# EAGLE design Lab2-th (EAGLE 7.2.0)
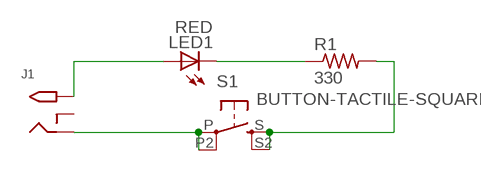
[diagram p0: schematic, sheet 1]

## Parts
J1  2.1MMJACKTHM  [PJ-102A]
LED1  RED  LED5MM  [LED5MM]
R1  330  RESISTORTH-1/4W-CARBON  [RESAD1160W55L680D260_HS]
S1  BUTTON-TACTILE-SQUARE  [BUTTON-TACTILE-SQUARE-ADAFRUIT1010]

## Nets
N$1: LED1.K(C) R1.1
N$2: R1.2 S1.S S1.S2(S1)
N$3: J1.RING S1.P S1.P2(P1)
N$4: J1.TIP LED1.A
Unconnected: J1.RING_SW

## Library data of the parts
J1 = Lab2:2.1MMJACK: 2.1mm x 5.5mm THM DC jack with internal switch. Digikey part #PJ-102A, 4UCON part #05537 2.1mm x 5.5mm SMT DC jack with internal switch. Digikey part #PJ-002A-SMT, 4UCON part #03267 By microbuilder.eu & adafruit.com
LED1 = Lab2:LED: LED OSRAM: - CHIPLED LG R971, LG N971, LY N971, LG Q971, LY Q971, LO R971, LY R971 LH N974, LH R974 LS Q976, LO Q976, LY Q976 LO Q996 - Hyper CHIPLED LW Q18S LB Q993, LB Q99A, LB R99A - SideLED LS A670, LO A670, LY A670, LG A670, LP A670 LB A673, LV A673, LT A673, LW A673 LH A674 LY A675 LS A676, LA A676, LO A676, LY A676, LW A676 LS A679, LY A679, LG A679 - Hyper Micro SIDELED® LS Y876, LA Y876, LO Y876, LY Y876 LT Y87S - SmartLED LW L88C, LW L88S LB L89C, LB L89S, LG L890 LS L89K, LO L89K, LY L89K LS L896, LA L896, LO L896, LY L896 - TOPLED LS T670, LO T670, LY T670, LG T670, LP T670 LSG T670, LSP T670, LSY T670, LOP T670, LYG T670 LG T671, LOG T671, LSG T671 LB T673, LV T673, LT T673, LW T673 LH T674 LS T676, LA T676, LO T676, LY T676, LB T676, LH T676, LSB T676, LW T676 LB T67C, LV T67C, LT T67C, LS T67K, LO T67K, LY T67K, LW E67C LS E67B, LA E67B, LO E67B, LY E67B, LB E67C, LV E67C, LT E67C LW T67C LS T679, LY T679, LG T679 LS T770, LO T770, LY T770, LG T770, LP T770 LB T773, LV T773, LT T773, LW T773 LH T774 LS E675, LA E675, LY E675, LS T675 LS T776, LA T776, LO T776, LY T776, LB T776 LHGB T686 LT T68C, LB T68C - Hyper Mini TOPLED® LB M676 - Mini TOPLED Santana® LG M470 LS M47K, LO M47K, LY M47K Source: http://www.osram.convergy.de/
R1 = Lab2:RESISTOR
S1 = James_Lab2:BUTTON-TACTILE

## Board
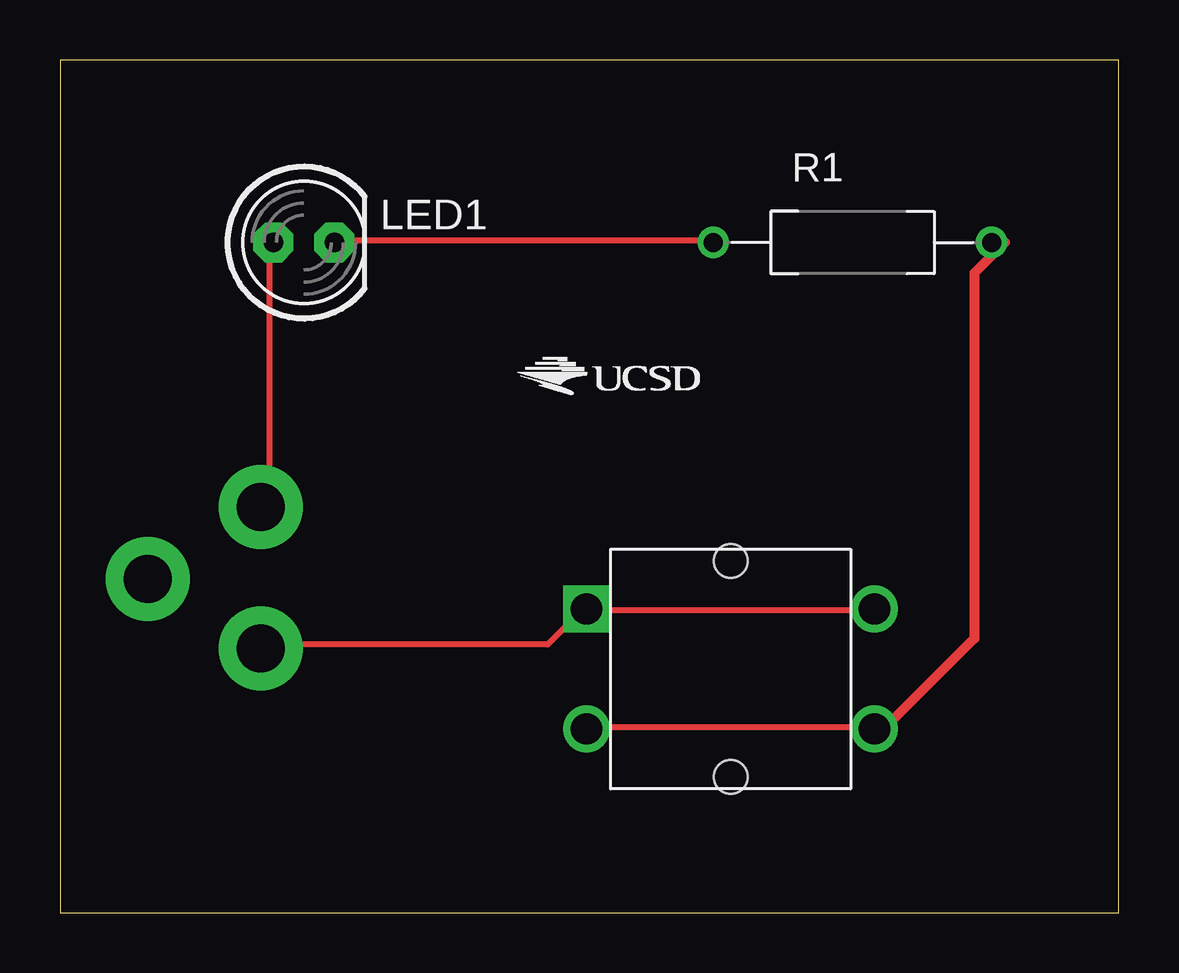
[diagram p1: board, top side]
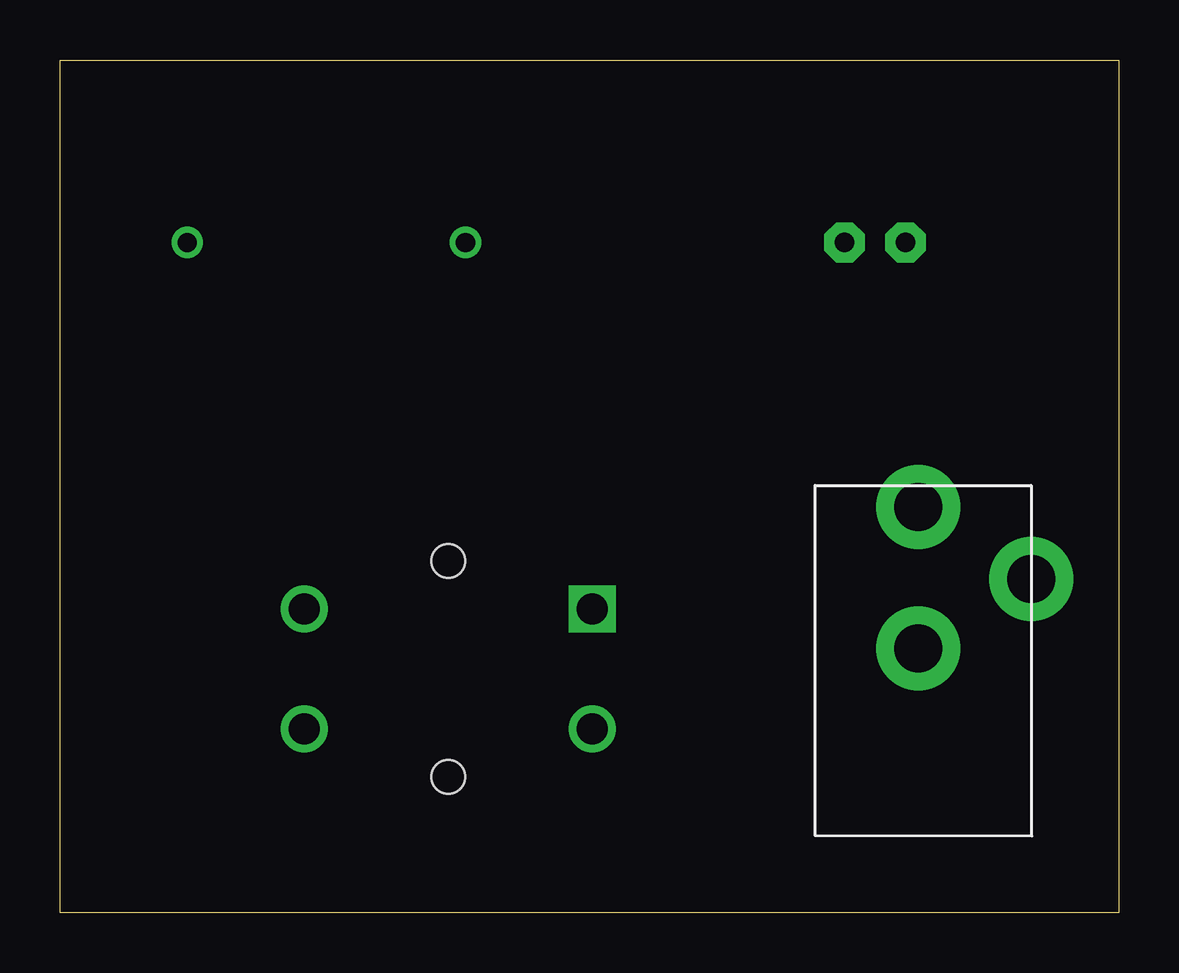
[diagram p2: board, bottom side, seen from below]

Size 44.12 x 35.55 mm. Coordinates in mm from the lower left corner, seen from the top.
Outline: 0,0 44.12,0 44.12,35.55 0,35.55 0,0
Copper layers (1*16): Top 0.035559375mm / dielectric 1.501140625mm / Bottom 0.035559375mm
Design rules "4pcb-33board": minimum track width 10mil, minimum drill 15mil, track to track 6mil, track to pad 6mil, pad to pad 6mil, via to via 6mil, smd to smd 6mil, copper to edge 10mil, drill to drill 10mil, minimum pad ring 10mil, minimum via ring 8mil, stop-mask expansion 4mil, vias tented up to drill 0mil, thermal gap 10mil

### Footprints (pad centres in the part's own frame; a part is rotated, then mirrored left to right if it is on the bottom)
PJ-102A = drill 2 pad 3.5: RING -6.77,-4.345; RING_SW -3.87,-9.045; TIP -0.87,-4.345
LED5MM = drill 0.813 pad 1.676 octagon: A -1.27,0; K 1.27,0
RESAD1160W55L680D260_HS = drill 0.8 pad 1.2: 1 -5.8,0; 2 5.8,0
BUTTON-TACTILE-SQUARE-ADAFRUIT1010 = drill 1.3 square: P -6,2.5 | drill 1.3: P2 6,2.5; S -6,-2.5; S2 6,-2.5 | hole 1.4: 0,4.5; 0,-4.5

### Placement (x,y rotation side)
J1  12.7,17.78 90 bottom
LED1  10.16,27.94 0 top
R1  33.02,27.94 0 top
S1  27.94,10.16 0 top
U$1  [UCSD_LOGO]  19.05,21.59 0 top

### Tracks (layer width: path | path; a pad name or v marks a point on that pad's centre or on a via)
N$1
  Top 0.254: R1.1 27.03,28.04 11.58,28.04 LED1.K
N$2
  Top 0.254: S1.S 21.95,7.72 33.93,7.72 S1.S2
  Top 0.406: R1.2 39.37,27.94 38.1,26.67 38.1,11.43 34.29,7.62 S1.S2
N$3
  Top 0.254: S1.P2 33.93,12.6 21.95,12.6 S1.P 21.74,12.6 20.32,11.18 8.53,11.18 J1.RING
N$4
  Top 0.254: LED1.A 8.74,27.84 8.74,17.27 8.53,17.07 J1.TIP